# Altium project E_LOAD_MAR11.PrjPcb
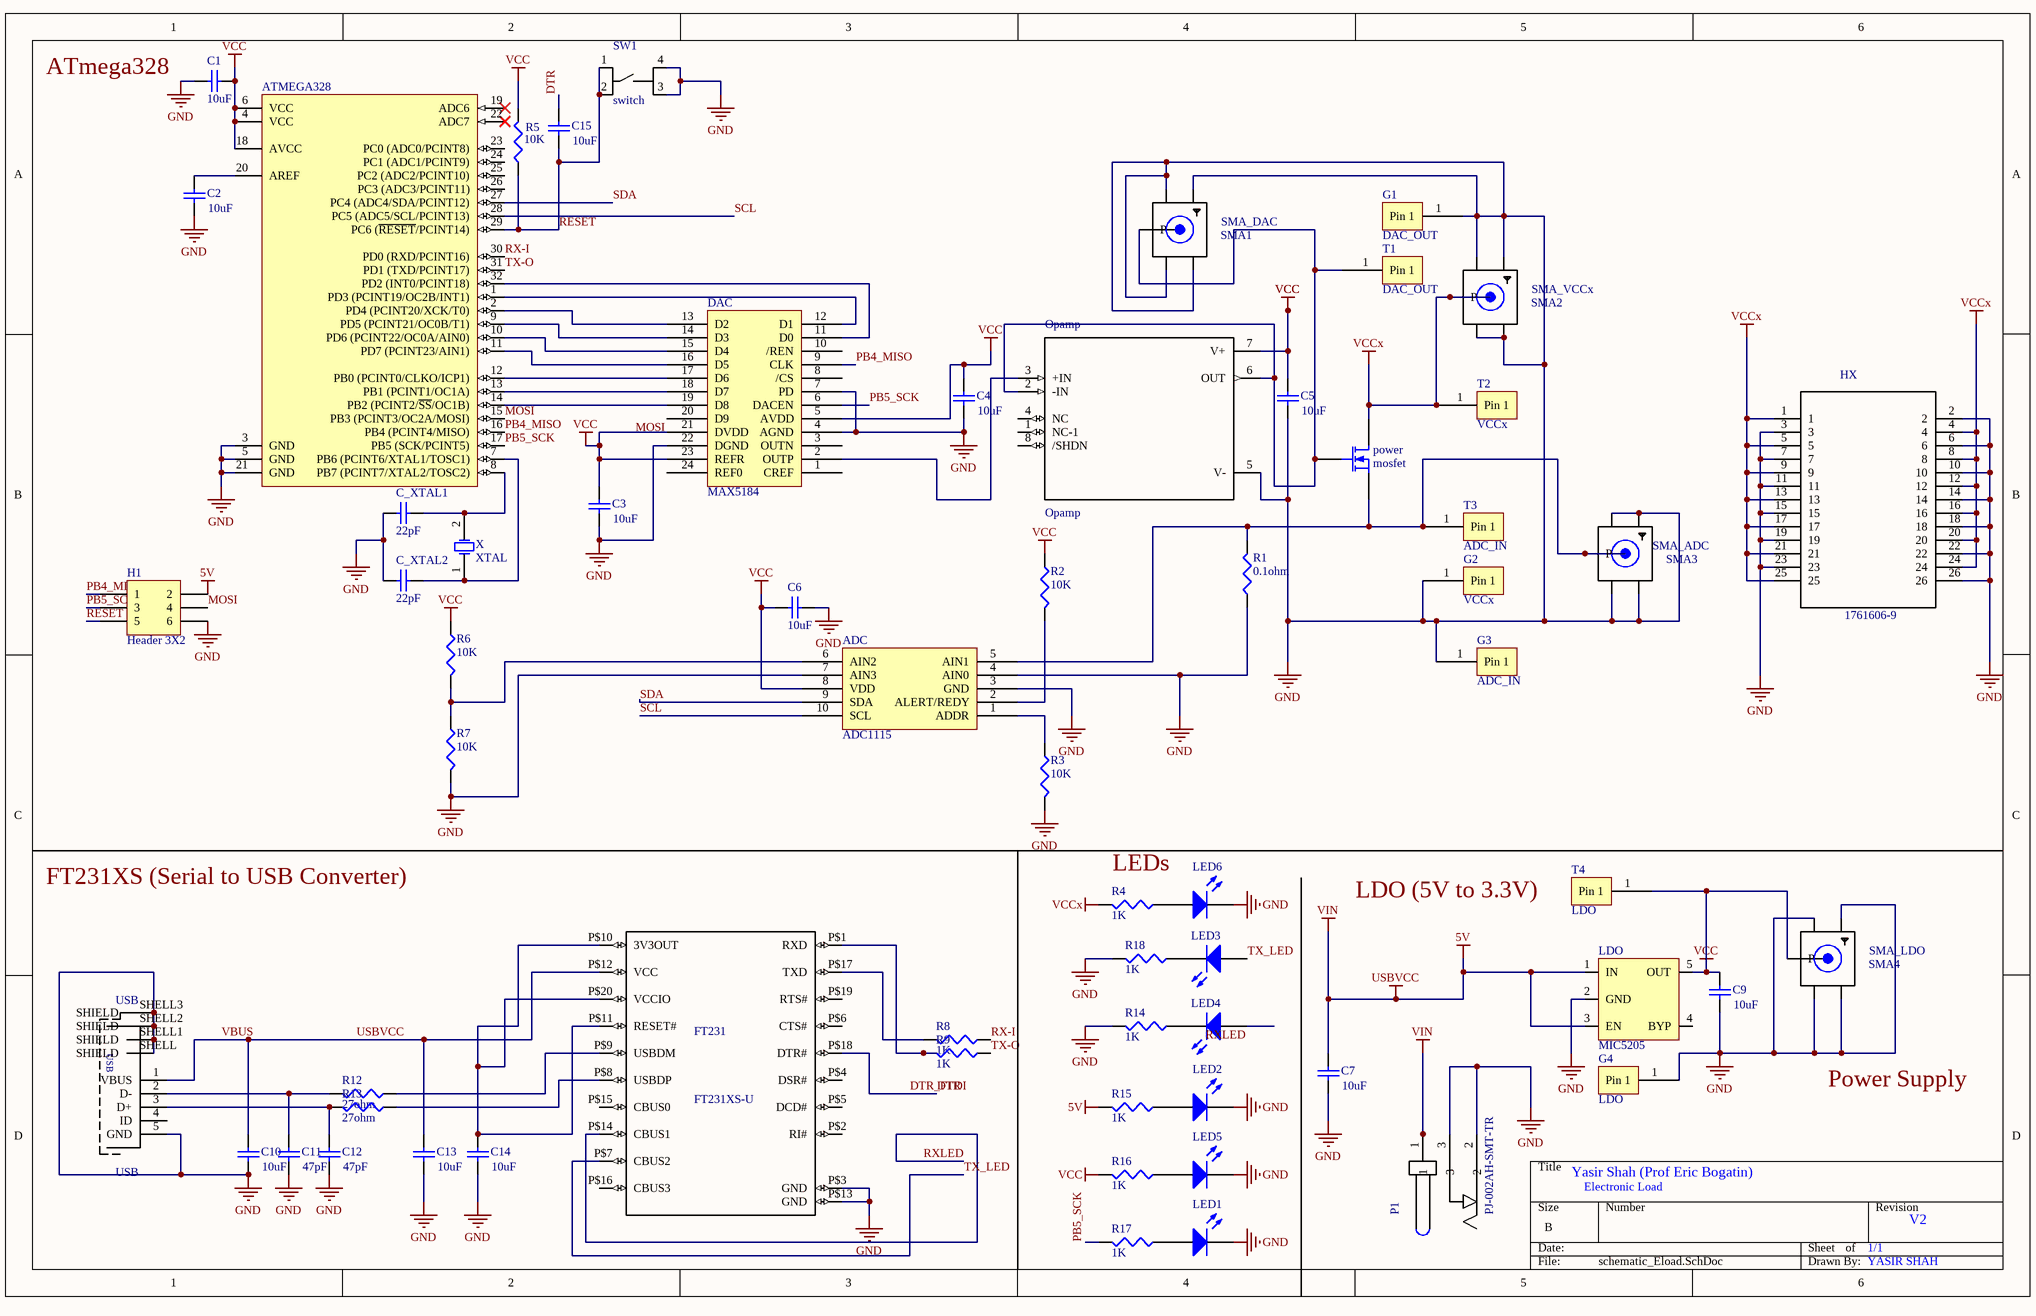
[diagram p0: schematic_Eload.SchDoc]
1 sheet, 63 parts. Net scope: global (net labels, ports and power ports of the same name join across sheets).
Board file: E_LOAD_MARCH20 - backup.PcbDoc

## Sheet schematic_Eload.SchDoc
size B

### Parts
ADC  ADC1115  [MSOP10]
ATMEGA328  ATmega328-AU  [QFP32P80_900X900X120L60X37N]  (value not drawn)
C1  value 10uF  [CAPC2012X140N]  (hidden comment: Cap Semi)
C2  value 10uF  [CAPC2012X140N]  (hidden comment: Cap Semi)
C3  value 10uF  [CAPC2012X140N]  (hidden comment: Cap Semi)
C4  value 10uF  [CAPC2012X140N]  (hidden comment: Cap Semi)
C5  value 10uF  [CAPC2012X140N]  (hidden comment: Cap Semi)
C6  value 10uF  [CAPC2012X140N]  (hidden comment: Cap Semi)
C7  value 10uF  [CAPC2012X140N]  (hidden comment: Cap Semi)
C9  value 10uF  [CAPC2012X140N]  (hidden comment: Cap Semi)
C10  value 10uF  [CAPC2012X140N]  (hidden comment: Cap Semi)
C11  value 47pF  [CAPC2012X140N]  (hidden comment: Cap Semi)
C12  value 47pF  [CAPC2012X140N]  (hidden comment: Cap Semi)
C13  value 10uF  [CAPC2012X140N]  (hidden comment: Cap Semi)
C14  value 10uF  [CAPC2012X140N]  (hidden comment: Cap Semi)
C15  value 10uF  [CAPC2012X140N]  (hidden comment: Cap Semi)
C_XTAL1  value 22pF  [CAPC2012X140N]  (hidden comment: Cap Semi)
C_XTAL2  value 22pF  [CAPC2012X140N]  (hidden comment: Cap Semi)
DAC  MAX5184  [21-0055H_24]
FT231  FT231XS-U  [SSOP20_FT231XS-U(Primary)]
G1  DAC_OUT  [1Pin Header]
G2  VCCx  [1Pin Header]
G3  ADC_IN  [1Pin Header]
G4  LDO  [1Pin Header]
H1  Header 3X2  [HDR2X3]
HX  1761606-9  [TYCO_1761606-9]
LDO  MIC5205  [SOT23-5]
LED1  LED2  [C1206]  (value not drawn)
LED2  LED2  [C1206]  (value not drawn)
LED3  LED2  [C1206]  (value not drawn)
LED4  LED2  [C1206]  (value not drawn)
LED5  LED2  [C1206]  (value not drawn)
LED6  LED2  [C1206]  (value not drawn)
Opamp  Opamp  [SOP65P490X110-8N]
P1  PJ-002AH-SMT-TR  [CUI_PJ-002AH-SMT-TR]
power  mosfet  [E3]
R1  0.1ohm  [RESC3216X65]
R2  value 10K  [RESC2012X70]  (hidden comment: Res3)
R3  value 10K  [RESC2012X70]  (hidden comment: Res3)
R4  value 1K  [RESC2012X70]  (hidden comment: Res3)
R5  value 10K  [RESC2012X70]  (hidden comment: Res3)
R6  value 10K  [RESC2012X70]  (hidden comment: Res3)
R7  value 10K  [RESC2012X70]  (hidden comment: Res3)
R8  value 1K  [RESC2012X70]  (hidden comment: Res3)
R9  value 1K  [RESC2012X70]  (hidden comment: Res3)
R12  value 27ohm  [RESC2012X70]  (hidden comment: Res3)
R13  value 27ohm  [RESC2012X70]  (hidden comment: Res3)
R14  value 1K  [RESC2012X70]  (hidden comment: Res3)
R15  value 1K  [RESC2012X70]  (hidden comment: Res3)
R16  value 1K  [RESC2012X70]  (hidden comment: Res3)
R17  value 1K  [RESC2012X70]  (hidden comment: Res3)
R18  value 1K  [RESC2012X70]  (hidden comment: Res3)
SMA_ADC  SMA3  [ADAFRUIT_1865_1865(Primary)]
SMA_DAC  SMA1  [ADAFRUIT_1865_1865(Primary)]
SMA_LDO  SMA4  [ADAFRUIT_1865_1865(Primary)]
SMA_VCCx  SMA2  [ADAFRUIT_1865_1865(Primary)]
SW1  switch  [TE_1-1825910-4]
T1  DAC_OUT  [1Pin Header]
T2  VCCx  [1Pin Header]
T3  ADC_IN  [1Pin Header]
T4  LDO  [1Pin Header]
USB  USB  [651005136521_651005136521(Primary)]
X  XTAL  [R38]

### Nets
GND: ADC.3(GND) ADC.4(AIN0) ADC.7(AIN3) ATMEGA328.3(GND) ATMEGA328.5(GND) ATMEGA328.21(GND) C1.2 C2.1 C3.1 C4.1 C5.1 C6.1 C7.1 C9.1 C10.1 C11.1 C12.1 C13.1 C14.1 C_XTAL1.2 C_XTAL2.2 DAC.4(AGND) DAC.7(PD) DAC.22(DGND) FT231.P$3(GND) FT231.P$13(GND) G1.1(Pin_1) G2.1(Pin_1) G3.1(Pin_1) G4.1(Pin_1) H1.6 HX.2 HX.3 HX.6 HX.7 HX.10 HX.11 HX.14 HX.15 HX.18 HX.19 HX.22 HX.23 HX.26 LDO.2(GND) LED1.2(K) LED2.2(K) LED5.2(K) LED6.2(K) Opamp.5(V-) P1.2 P1.3 R1.1 R3.2 R7.2 R14.2 R18.2 SMA_ADC.GND1 SMA_ADC.GND2 SMA_ADC.GND3 SMA_ADC.GND4 SMA_DAC.GND1 SMA_DAC.GND2 SMA_DAC.GND3 SMA_DAC.GND4 SMA_LDO.GND1 SMA_LDO.GND2 SMA_LDO.GND3 SMA_LDO.GND4 SMA_VCCx.GND1 SMA_VCCx.GND2 SMA_VCCx.GND3 SMA_VCCx.GND4 SW1.3 SW1.4 USB.5(GND) USB.SHELL(SHIELD) USB.SHELL1(SHIELD) USB.SHELL2(SHIELD) USB.SHELL3(SHIELD)
USBVCC: C7.2 C10.2 C13.2 FT231.P$12(VCC) H1.2 LDO.1(IN) LDO.3(EN) P1.1 R15.2 USB.1(VBUS)  [also labelled 5V, VBUS, VIN]
VCC: ADC.8(VDD) ATMEGA328.4(VCC) ATMEGA328.6(VCC) ATMEGA328.18(AVCC) C1.1 C3.2 C4.2 C5.2 C6.2 C9.2 DAC.5(AVDD) DAC.21(DVDD) DAC.23(REFR) LDO.5(OUT) Opamp.7(V+) R2.1 R5.2 R6.1 R16.2 SMA_LDO.P T4.1(Pin_1)
VCCx: HX.1 HX.4 HX.5 HX.8 HX.9 HX.12 HX.13 HX.16 HX.17 HX.20 HX.21 HX.24 HX.25 power.1(D) R4.2 SMA_VCCx.P T2.1(Pin_1)
DTR: C15.2 FT231.P$18(DTR#)  [also labelled DTR_FTDI]
MOSI: ATMEGA328.15(PB3_(PCINT3/OC2A/MOSI)) DAC.20(D9) H1.4
PB4_MISO: ATMEGA328.16(PB4_(PCINT4/MISO)) DAC.9(CLK) H1.1
PB5_SCK: ATMEGA328.17(PB5_(SCK/PCINT5)) DAC.6(DACEN) H1.3 R17.2
RESET: ATMEGA328.29(PC6_(~{RESET}/PCINT14)) C15.1 H1.5 R5.1 SW1.1 SW1.2
RX-I: ATMEGA328.30(PD0_(RXD/PCINT16)) R8.1
RXLED: FT231.P$14(CBUS1) LED4.1(A)
SCL: ADC.10(SCL) ATMEGA328.28(PC5_(ADC5/SCL/PCINT13))
SDA: ADC.9(SDA) ATMEGA328.27(PC4_(ADC4/SDA/PCINT12))
TX-O: ATMEGA328.31(PD1_(TXD/PCINT17)) R9.1
TX_LED: FT231.P$7(CBUS2) LED3.1(A)
NetADC_1: ADC.1(ADDR) R3.1
NetADC_2: ADC.2(ALERT/REDY) R2.2
NetADC_5: ADC.5(AIN1) power.3(S) R1.2 SMA_ADC.P T3.1(Pin_1)
NetADC_6: ADC.6(AIN2) R6.2 R7.1
NetATMEGA328_1: ATMEGA328.1(PD3_(PCINT19/OC2B/INT1)) DAC.12(D1)
NetATMEGA328_2: ATMEGA328.2(PD4_(PCINT20/XCK/T0)) DAC.13(D2)
NetATMEGA328_7: ATMEGA328.7(PB6_(PCINT6/XTAL1/TOSC1)) C_XTAL2.1 X.1(OSC1)
NetATMEGA328_8: ATMEGA328.8(PB7_(PCINT7/XTAL2/TOSC2)) C_XTAL1.1 X.2(OSC2)
NetATMEGA328_9: ATMEGA328.9(PD5_(PCINT21/OC0B/T1)) DAC.14(D3)
NetATMEGA328_10: ATMEGA328.10(PD6_(PCINT22/OC0A/AIN0)) DAC.15(D4)
NetATMEGA328_11: ATMEGA328.11(PD7_(PCINT23/AIN1)) DAC.16(D5)
NetATMEGA328_12: ATMEGA328.12(PB0_(PCINT0/CLKO/ICP1)) DAC.17(D6)
NetATMEGA328_13: ATMEGA328.13(PB1_(PCINT1/OC1A)) DAC.18(D7)
NetATMEGA328_14: ATMEGA328.14(PB2_(PCINT2/~{SS}/OC1B)) DAC.19(D8)
NetATMEGA328_20: ATMEGA328.20(AREF) C2.2
NetATMEGA328_32: ATMEGA328.32(PD2_(INT0/PCINT18)) DAC.11(D0)
NetC11_2: C11.2 R12.2 USB.2(D-)
NetC12_2: C12.2 R13.2 USB.3(D+)
NetC14_2: C14.2 FT231.P$10(3V3OUT) FT231.P$11(RESET#) FT231.P$20(VCCIO)
NetDAC_2: DAC.2(OUTP) Opamp.3(+IN)
NetFT231_P$1: FT231.P$1(RXD) R9.2
NetFT231_P$8: FT231.P$8(USBDP) R13.1
NetFT231_P$9: FT231.P$9(USBDM) R12.1
NetFT231_P$17: FT231.P$17(TXD) R8.2
NetLED1_1: LED1.1(A) R17.1
NetLED2_1: LED2.1(A) R15.1
NetLED3_2: LED3.2(K) R18.1
NetLED4_2: LED4.2(K) R14.1
NetLED5_1: LED5.1(A) R16.1
NetLED6_1: LED6.1(A) R4.1
NetOpamp_2: Opamp.2(-IN) Opamp.6(OUT) power.2(G) SMA_DAC.P T1.1(Pin_1)

Not connected (* = marked no-connect by the designer): ATMEGA328 19(ADC6)* 22(ADC7)* 23(PC0_(ADC0/PCINT8)) 24(PC1_(ADC1/PCINT9)) 25(PC2_(ADC2/PCINT10)) 26(PC3_(ADC3/PCINT11)); DAC 1(CREF) 3(OUTN) 8(/CS) 10(/REN) 24(REF0); FT231 P$2(RI#) P$4(DSR#) P$5(DCD#) P$6(CTS#) P$15(CBUS0) P$16(CBUS3) P$19(RTS#); LDO 4(BYP); Opamp 1(NC-1) 4(NC) 8(/SHDN); USB 4(ID)

### Notes on the sheet
- (near C1) ATmega328
- FT231XS (Serial to USB Converter)
- LEDs
- LDO (5V to 3.3V)
- Power Supply
- Yasir Shah (Prof Eric Bogatin)
- Electronic Load
- 1/1
- V2
- YASIR SHAH

### Library data of the parts
ADC = ADC
ATMEGA328 = ATmega328-AU: 8-bit AVR Microcontroller, 32KB Flash, 1KB EEPROM, 2KB SRAM, 32-pin TQFP, Industrial Grade (-40°C to 85°C); Published: 1-Apr-2010; DatasheetVersion: revA, Jan-2010; PackageVersion: revB, Oct-2001; PackageReference: 32A; Publisher: Altium Limited; PackageDescription: 32-Lead, 7x7x1.0 mm Body, 0.8mm Lead Pitch, Thin Profile Plastic Quad Flat Package (TQFP); Supplier 1: Digi-Key; Supplier Part Number 1: ATMEGA328-AU-ND; Supplier 2: Mouser; Supplier Part Number 2: 556-ATMEGA328-AU; Code_JEDEC: MS-026-ABA; ComponentLink1Description: Manufacturer Link; ComponentLink1URL: http://www.atmel.com/products/avr/default.asp?; ComponentLink2Description: ATmega48A/48PA/88A/88PA/168A/168PA/328/328P Datasheet; ComponentLink2URL: http://www.atmel.com/dyn/resources/prod_documents/8271.pdf; ComponentLink3Description: ATmega48A/48PA/88A/88PA/168A/168PA/328/328P Summary; ComponentLink3URL: http://www.atmel.com/dyn/resources/prod_documents/8271S.pdf; ComponentLink4Description: Atmel.com Home; ComponentLink4URL: http://www.atmel.com
C1-C7 C9-C15 C_XTAL1 C_XTAL2 = Cap Semi: Capacitor (Semiconductor SIM Model); Published: 8-Jun-2000; LatestRevisionDate: 29-May-2009; LatestRevisionNote: IPC-7351 Footprint Added.; PackageReference: C1206; Publisher: Altium Limited; PackageDescription: Chip Capacitor
FT231 = FT231XS-U: USB Full Speed to Full Handshake UART with USB Charger Detection, SSOP-20; MF: FTDI,; SnapEDA_Link: https://www.snapeda.com/symbols-footprints/FT231XS-U/FTDI%2C%20Future%20Technology%20Devices%20International%20Ltd/view-part/?ref=snap; MP: FT231XS-U; Availability: Good; Package: SSOP-20 FTDI; Price: 2.02 USD; Value: *
G1-G4 T1-T4 = 1Pin Header
H1 = Header 3X2: Header, 3-Pin, Dual row; LatestRevisionDate: 17-Jul-2002; LatestRevisionNote: Re-released for DXP Platform.; Publisher: Altium Limited
HX = 1761606-9: Header, Pin, Idc, Amp-Latch, 26 Pos, Low Profile, Pcb, Vertical, Black; MF: TE Connectivity; Link: http://www.te.com/usa-en/product-1761606-9.html; Package: None; EU_RoHS_Compliance: Compliant; MP: 1761606-9; Availability: Good; Price: 4.02 USD; SnapEDA_Link: https://www.snapeda.com/symbols-footprints/1761606-9/TE%20Connectivity%20AMP%20Connectors/view-part/?ref=snap; Value: *
LED1-LED6 = LED2: Typical RED, GREEN, YELLOW, AMBER GaAs LED; Published: 8-Jun-2000; LatestRevisionDate: 17-Jul-2002; LatestRevisionNote: Re-released for DXP Platform.; PackageVersion: Feb-2002; PackageReference: 3.2X1.6X1.1; Publisher: Altium Limited; PackageDescription: SM LED; 2 Flat Leads
Opamp = LTC6269IMS8E#PBF: LTC6269 - Dual 500MHz Ultra-Low Bias Current FET Input Op Amp; MF: Linear Technology; SnapEDA_Link: https://www.snapeda.com/symbols-footprints/LTC6269IMS8E%23PBF/Linear%20Technology/view-part/?ref=snap; Price: 6.38 USD; Availability: Warning; Package: MSOP-8 Linear Technology; MP: LTC6269IMS8E#PBF; Value: *
P1 = PJ-002AH-SMT-TR: 24 VDC 5 A Surface Mount Unshielded 2 Conductors 3 Contacts Male Power Jack; MF: CUI; Package: None; MP: PJ-002AH-SMT-TR; Availability: Good; Price: 1.03 USD; SnapEDA_Link: https://www.snapeda.com/symbols-footprints/PJ-002AH-SMT-TR/CUI%20Inc/view-part/?ref=snap; Value: *
power = MOSFET-N: N-Channel MOSFET; Published: 8-Jun-2000; LatestRevisionDate: 17-Jul-2002; LatestRevisionNote: Re-released for DXP Platform.; PackageVersion: 1995/1996; PackageReference: E3; Publisher: Altium Limited; PackageDescription: TO, Flat Index; 3 In-Line, Axial Leads; Body Dia. 4.6mm; Lead Dia. 0.5 mm (max)
R1-R9 R12-R18 = Res3: Resistor; Published: 8-Jun-2000; LatestRevisionDate: 29-May-2009; LatestRevisionNote: IPC-7351 Footprint Added.; PackageReference: J1-0603; Publisher: Altium Limited; PackageDescription: Chip Resistor
SMA_ADC SMA_DAC SMA_LDO SMA_VCCx = 1865: Edge-Launch SMA Connector for 1.6mm / 0.062 Thick PCBs; MF: Keystone; Availability: Bad; SnapEDA_Link: https://www.snapeda.com/symbols-footprints/1865/Keystone%20Electronics/view-part/?ref=snap; Package: None; MP: 1865; Price: 2.38 USD; Value: *
SW1 = 1-1825910-4: Switch Tactile OFF (ON) SPST Round Button PC Pins 0.05A 24VDC 100000Cycles 1.56N Thru-Hole Loose; MF: TE Connectivity; MP: 118259104; Package: None; Availability: Good; Price: 0.07 USD; SnapEDA_Link: https://www.snapeda.com/symbols-footprints/118259104/TE%20Connectivity/view-part/?ref=snap; Value: *
USB = 651005136521: MINI USB A - 5POS Horizontal through hole; MF: Wurth Electronics; SnapEDA_Link: https://www.snapeda.com/symbols-footprints/651005136521/Wurth%20Electronics%20Inc/view-part/?ref=snap; MP: 651005136521; Package: None; Availability: Good; Price: 1.78 USD; Value: *
X = XTAL: Crystal Oscillator; Published: 8-Jun-2000; LatestRevisionDate: 17-Jul-2002; LatestRevisionNote: Re-released for DXP Platform.; PackageReference: R38; Publisher: Altium Limited; PackageDescription: Crystal, Thru-Hole; 2 Leads; Body 3.1 x 8.2 mm (Dia.xH)